# Altium schematic sheet BMW Side Turn Signal.SchDoc
size A4
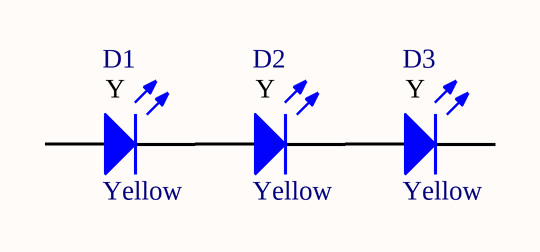
[diagram p0: BMW Side Turn Signal.SchDoc]

## Parts
D1  Yellow  [LED Round 5mm Yellow]
D2  Yellow  [LED Round 5mm Yellow]
D3  Yellow  [LED Round 5mm Yellow]

## Nets
NetD1_2: D1.2(K) D2.1(A)
NetD2_2: D2.2(K) D3.1(A)

Not connected (* = marked no-connect by the designer): D1 1(A); D3 2(K)

## Notes on the sheet
- (in symbol Led Round 5mm Yellow) Y

## Library data of the parts
D1-D3 = Led Round 5mm Yellow: 2.8-3v 25mA, 4-5cd; Forward Voltage Min: 2.8; Forward Voltage TYP: 3; Wave len min/typ: 580/590; Liminous Min (mcd): 4000; Liminous Typ (mcd): 5000; Forward Amp (mA): 25; Color: Yellow